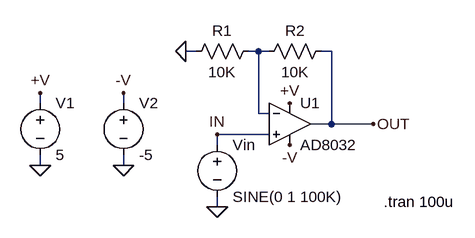
[diagram p0: schematic AD8032.asc]
AD8032.asc, the LTspice schematic file:
Version 4
SHEET 1 1240 700
WIRE 432 -1216 416 -1216
WIRE 528 -1216 512 -1216
WIRE 544 -1216 528 -1216
WIRE 640 -1216 624 -1216
WIRE 192 -1136 192 -1152
WIRE 320 -1136 320 -1152
WIRE 528 -1120 528 -1216
WIRE 544 -1120 528 -1120
WIRE 640 -1104 640 -1216
WIRE 640 -1104 608 -1104
WIRE 704 -1104 640 -1104
WIRE 544 -1088 464 -1088
WIRE 464 -1072 464 -1088
WIRE 192 -1040 192 -1056
WIRE 320 -1040 320 -1056
WIRE 464 -976 464 -992
FLAG 192 -1152 +V
FLAG 464 -976 0
FLAG 704 -1104 OUT
FLAG 464 -1088 IN
FLAG 576 -1136 +V
FLAG 320 -1152 -V
FLAG 576 -1072 -V
FLAG 416 -1216 0
FLAG 320 -1040 0
FLAG 192 -1040 0
SYMBOL voltage 192 -1152 R0
WINDOW 123 0 0 Left 2
WINDOW 39 0 0 Left 2
SYMATTR InstName V1
SYMATTR Value 5
SYMBOL voltage 464 -1088 R0
WINDOW 123 24 146 Left 2
WINDOW 39 24 125 Left 2
SYMATTR InstName Vin
SYMATTR Value SINE(0 1 100K)
SYMBOL res 528 -1232 R90
WINDOW 0 0 56 VBottom 2
WINDOW 3 32 56 VTop 2
SYMATTR InstName R1
SYMATTR Value 10K
SYMBOL res 640 -1232 R90
WINDOW 0 0 56 VBottom 2
WINDOW 3 32 56 VTop 2
SYMATTR InstName R2
SYMATTR Value 10K
SYMBOL voltage 320 -1152 R0
WINDOW 123 24 146 Left 2
WINDOW 39 24 125 Left 2
SYMATTR InstName V2
SYMATTR Value -5
SYMBOL opamps\\AD8032 576 -1168 R0
SYMATTR InstName U1
TEXT 720 -984 Left 2 !.tran 100u

The netlist it stands for:
* AD8032.asc
V1 +V 0 5
Vin IN 0 SINE(0 1 100K)
R1 N001 0 10K
R2 OUT N001 10K
V2 -V 0 -5
XU1 IN N001 +V -V OUT AD8032  ; pins In+ In- V+ V- OUT
.tran 100u
.backanno
.end